# EAGLE design AirSensor_HIH8xxx (EAGLE 9.6.2)
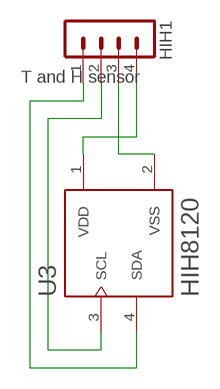
[diagram p0: schematic, sheet 1]

## Parts
HIH1  T and H sensor  MA04-1  [MA04-1]
U3  HIH8120  HIH8120-021-001  [SIP191W41P127L490H390Q4]

## Nets
N$28: HIH1.3 U3.2(VSS)
N$29: HIH1.4 U3.1(VDD)
N$30: HIH1.1 U3.4(SDA)
N$31: HIH1.2 U3.3(SCL)

## Library data of the parts
HIH1 = con-lstb:MA04-1: PIN HEADER; OC_FARNELL: unknown; OC_NEWARK: unknown
U3 = HIH8120-021-001:HIH8120-021-001: Sensor: temperature and humidity sensor; digital; ±2%; Case: SIP4 Check prices <https://pricing.snapeda.com/search/part/HIH8120-021-001/?ref=eda>; AVAILABILITY: Good; DESCRIPTION: Humidity Temperature Sensor 0 ~ 100% RH I²C ±2% RH 6s Through Hole; MF: Honeywell Sensing; MP: HIH8120-021-001; PACKAGE: SIP-4 Honeywell; PRICE: None; PURCHASE-URL: https://pricing.snapeda.com/search/part/HIH8120-021-001/?ref=eda

## Board
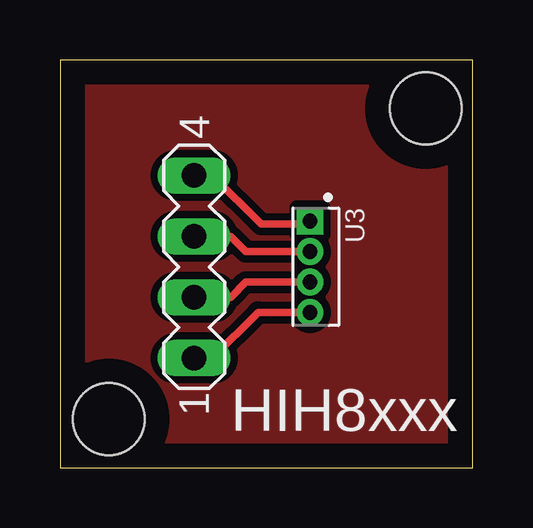
[diagram p1: board, top side]

Size 17.2 x 17.01 mm. Coordinates in mm from the lower left corner, seen from the top.
Outline: 0,0 17.2,0 17.2,17.01 0,17.01 0,0
Copper layers (1*16): Top 0.035mm / dielectric 1.5mm / Bottom 0.035mm
Design rules "default": minimum track width 6mil, minimum drill 0.35mm, track to track 6mil, track to pad 6mil, pad to pad 6mil, via to via 6mil, smd to smd 6mil, copper to edge 40mil, drill to drill 6mil, minimum pad ring 10mil, minimum via ring 8mil, stop-mask expansion 4mil, vias tented up to drill 0mil, thermal gap 10mil
Holes 3 mm at 15.24,14.99 2.03,2.03

### Footprints (pad centres in the part's own frame; a part is rotated, then mirrored left to right if it is on the bottom)
MA04-1 = drill 1.016 long: 1 -3.81,0; 2 -1.27,0; 3 1.27,0; 4 3.81,0
SIP191W41P127L490H390Q4 = drill 0.61 pad 1.01 square: 1 -1.905,0 | drill 0.61 pad 1.01: 2 -0.635,0; 3 0.635,0; 4 1.905,0

### Placement (x,y rotation side)
HIH1  5.59,8.38 90 top
U3  10.41,8.38 270 top

### Tracks (layer width: path | path; a pad name or v marks a point on that pad's centre or on a via)
GND
  pour Top (isolate 0.305): 0.25,16.76 0.25,0.25 17.02,0.25 17.02,16.76
N$28
  Top 0.305: HIH1.3 7.11,9.65 7.75,9.02 U3.2
N$29
  Top 0.305: HIH1.4 6.35,12.19 8.38,10.16 10.29,10.16 U3.1
N$30
  Top 0.305: HIH1.1 6.35,4.57 8.25,6.48 U3.4
N$31
  Top 0.305: HIH1.2 7.11,7.11 7.75,7.75 U3.3

### Text on the board
tNames: HIH8xxx